# EAGLE design MCP3421_adapter (EAGLE 7.5.0)
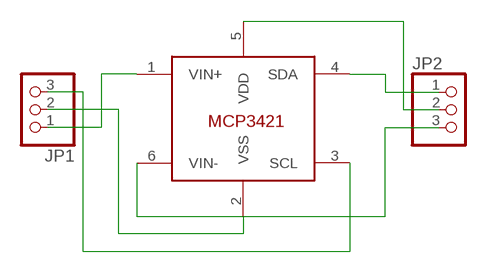
[diagram p0: schematic, sheet 1]

## Parts
JP1  PINHD-1X3  [1X03]
JP2  PINHD-1X3  [1X03]
U$1  MCP3421  [SOT23-6]

## Nets
N$1: JP1.1 U$1.1(VIN+)
N$2: JP1.2 U$1.2(VSS)
N$3: JP1.3 U$1.3(SCL)
N$4: JP2.1 U$1.4(SDA)
N$5: JP2.2 U$1.5(VDD)
N$6: JP2.3 U$1.6(VIN-)

## Library data of the parts
JP1 JP2 = pinhead:PINHD-1X3: PIN HEADER
U$1 = adafruit:MCP3421

## Board
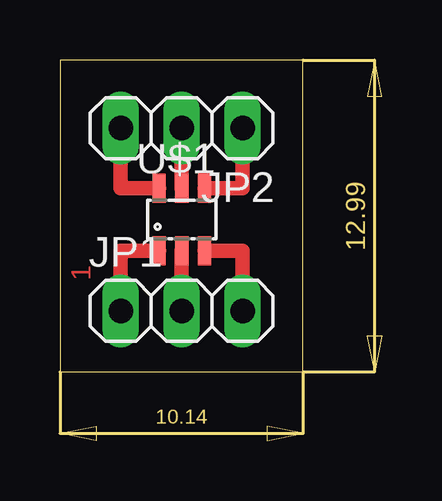
[diagram p1: board, top side]

Size 10.14 x 12.99 mm. Coordinates in mm from the lower left corner, seen from the top.
Outline: 0,0 10.14,0 10.14,12.99 0,12.99 0,0
Copper layers (1*16): Top 0.035mm / dielectric 1.5mm / Bottom 0.035mm
Design rules "default": minimum track width 10mil, minimum drill 24mil, track to track 8mil, track to pad 8mil, pad to pad 8mil, via to via 8mil, smd to smd 8mil, copper to edge 40mil, drill to drill 8mil, minimum pad ring 10mil, minimum via ring 8mil, stop-mask expansion 4mil, vias tented up to drill 0mil, thermal gap 10mil

### Footprints (pad centres in the part's own frame; a part is rotated, then mirrored left to right if it is on the bottom)
1X03 = drill 1.016 long: 1 -2.54,0; 2 0,0; 3 2.54,0
SOT23-6 = smd 0.55 x 1.2: 1 -0.95,-1.3; 2 0,-1.3; 3 0.95,-1.3; 4 0.95,1.3; 5 0,1.3; 6 -0.95,1.3

### Placement (x,y rotation side)
JP1  5.08,2.54 0 top
JP2  5.08,10.16 180 top
U$1  5.08,6.35 0 top

### Tracks (layer width: path | path; a pad name or v marks a point on that pad's centre or on a via)
N$1
  Top 0.61: U$1.1 2.54,5.05 JP1.1
N$2
  Top 0.61: U$1.2 JP1.2
N$3
  Top 0.61: U$1.3 7.62,5.05 JP1.3
N$4
  Top 0.61: U$1.4 7.62,7.65 JP2.1
N$5
  Top 0.61: U$1.5 JP2.2
N$6
  Top 0.61: U$1.6 2.54,7.65 JP2.3

### Text on the board
Top: 1